# EAGLE schematic uNimbus_board_2_v1_2 (EAGLE 9.3.1)

## Sheet 1 of 4
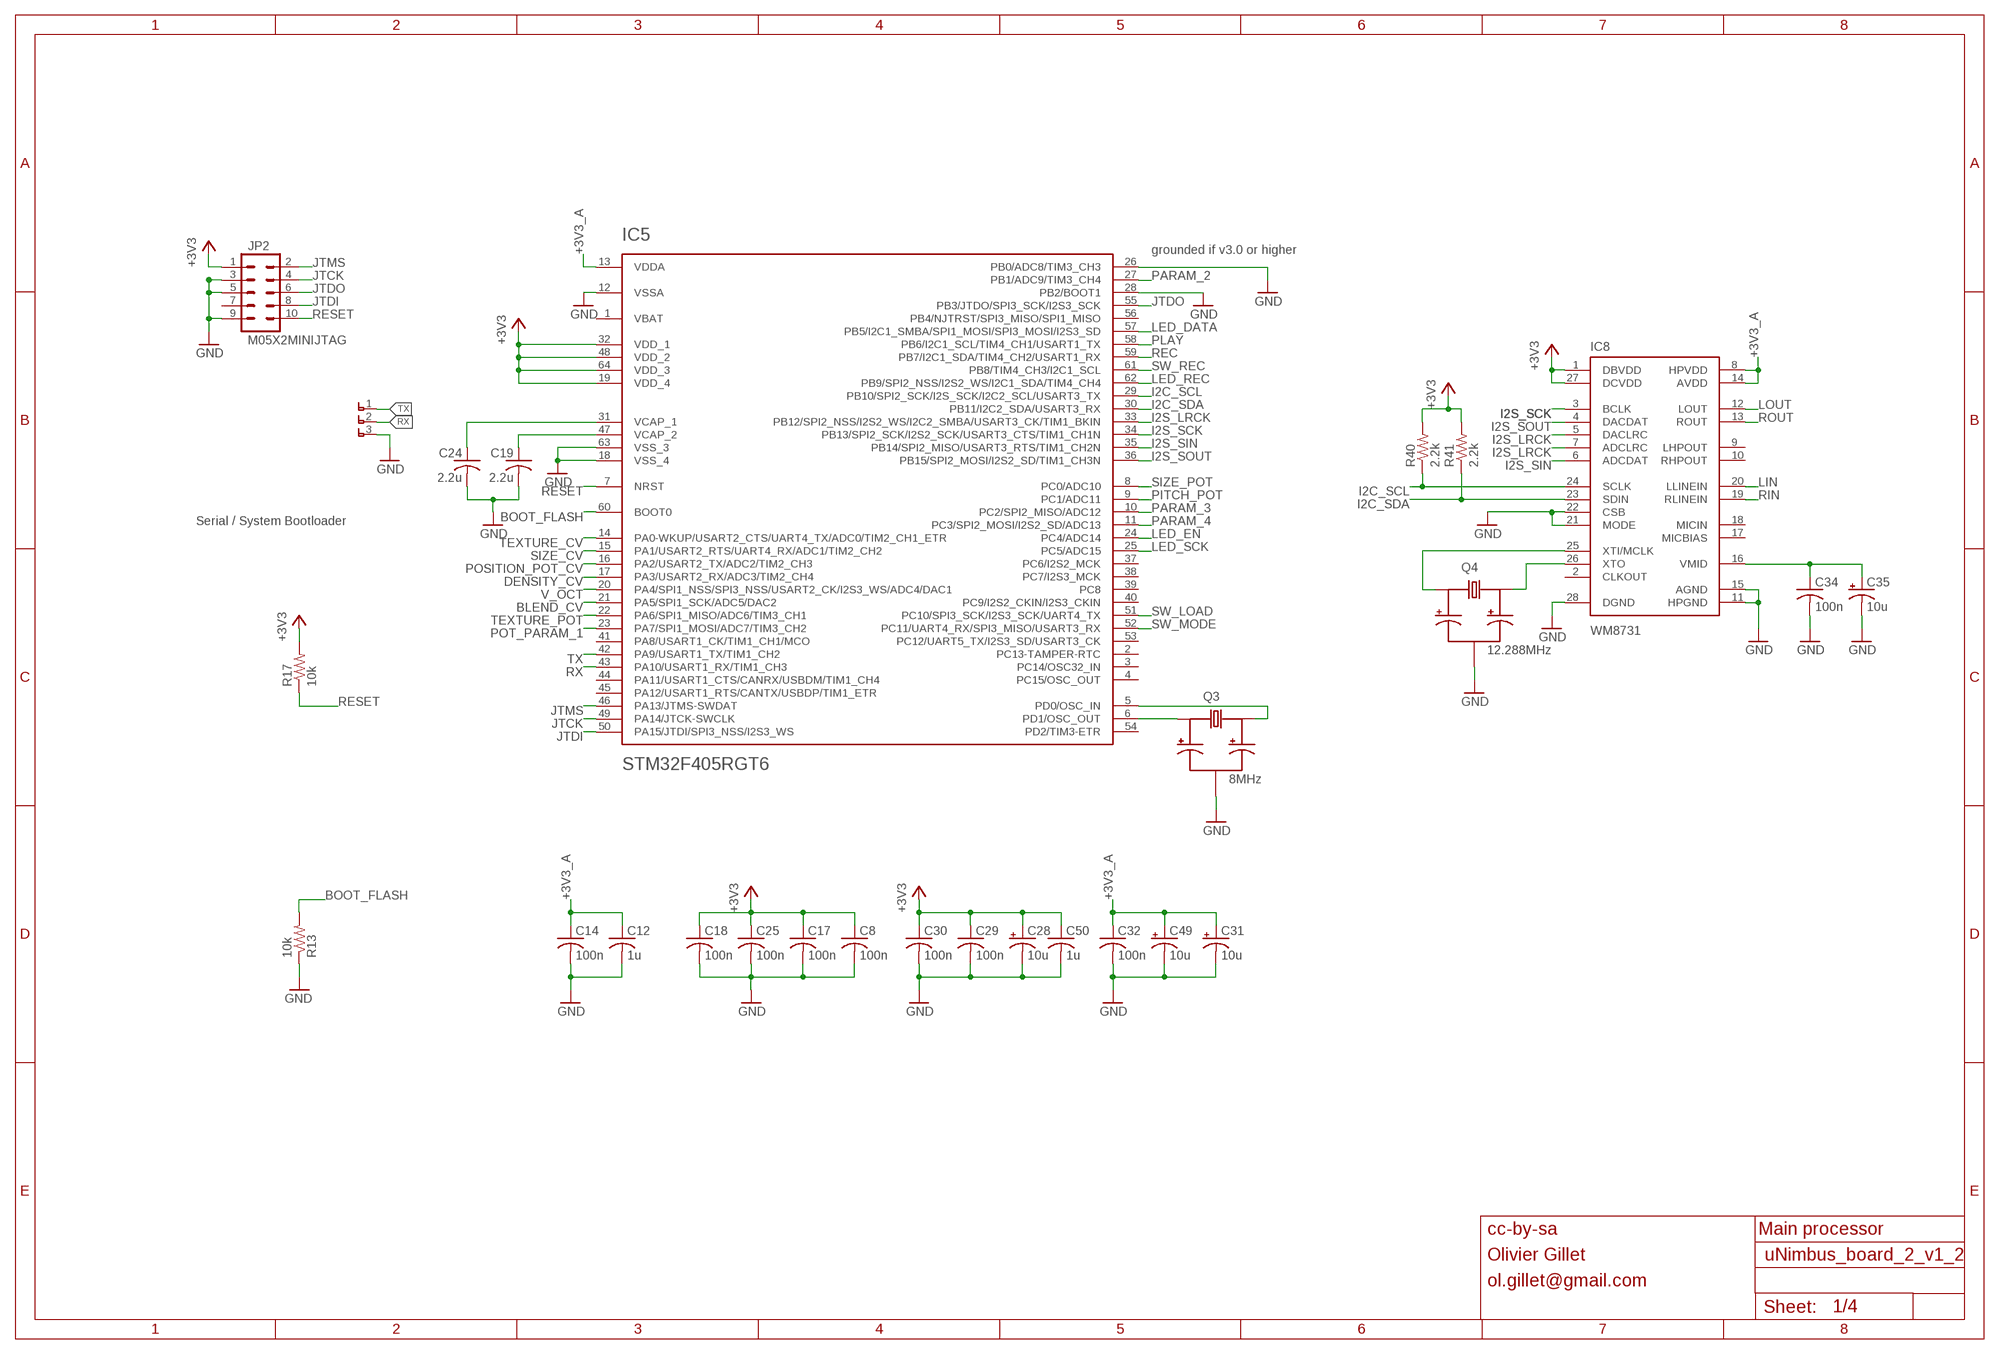
[diagram p0: schematic, sheet 1]

### Parts
C8  100n  C-USC0603  [C0603]
C12  1u  C-USC0603K  [C0603K]
C14  100n  C-USC0603K  [C0603K]
C17  100n  C-USC0603K  [C0603K]
C18  100n  C-USC0603K  [C0603K]
C19  2.2u  C-USC0805K  [C0805K]
C24  2.2u  C-USC0805K  [C0805K]
C25  100n  C-USC0603K  [C0603K]
C28  10u  CPOL-US153CLV-0405  [153CLV-0405]
C29  100n  C-USC0603K  [C0603K]
C30  100n  C-USC0603K  [C0603K]
C31  10u  CPOL-USB  [PANASONIC_B]
C32  100n  C-USC0603  [C0603]
C34  100n  C-USC0603  [C0603]
C35  10u  CPOL-USB  [PANASONIC_B]
C49  10u  CPOL-USA  [PANASONIC_A]
C50  1u  C-USC0603K  [C0603K]
IC5  STM32F405RGT6  STM32F20X  [TQFP-10X10-64]
IC8  WM8731  [SSOP28]
JP2  M05X2MINIJTAG  [2X5-1.27]
Q3  8MHz  CRYSTAL_SMALLER  [CRYSTAL_SMALLER]
Q4  12.288MHz  CRYSTAL_SMALLER  [CRYSTAL_SMALLER]
R13  10k  PARTS_AMAN_RESISTOR  [PARTS_AMAN_RESISTOR_0603]
R17  10k  PARTS_AMAN_RESISTOR  [PARTS_AMAN_RESISTOR_0603]
R40  2.2k  PARTS_AMAN_RESISTOR  [PARTS_AMAN_RESISTOR_0603]
R41  2.2k  PARTS_AMAN_RESISTOR  [PARTS_AMAN_RESISTOR_0603]
U$4  1X3_SMALL  [1X3_SMALL]

### Nets
+3V3: C8.1 C17.1 C18.1 C25.1 C28.+ C29.1 C30.1 C50.1 IC5.19(VDD_4) IC5.32(VDD_1) IC5.48(VDD_2) IC5.64(VDD_3) IC8.1(DBVDD) IC8.27(DCVDD) JP2.1 R17.2 R40.2 R41.2 ; also sheet 3,4
+3V3_A: C12.1 C14.1 C31.+ C32.1 C49.+ IC5.13(VDDA) IC8.8(HPVDD) IC8.14(AVDD) ; also sheet 2,3,4
BLEND_CV: IC5.21(PA5/SPI1_SCK/ADC5/DAC2) ; also sheet 2
BOOT_FLASH: IC5.60(BOOT0) R13.2
DENSITY_CV: IC5.17(PA3/USART2_RX/ADC3/TIM2_CH4) ; also sheet 2
GND: C8.2 C12.2 C14.2 C17.2 C18.2 C19.2 C24.2 C25.2 C28.- C29.2 C30.2 C31.- C32.2 C34.2 C35.- C49.- C50.2 IC5.12(VSSA) IC5.18(VSS_4) IC5.26(PB0/ADC8/TIM3_CH3) IC5.28(PB2/BOOT1) IC5.63(VSS_3) IC8.11(HPGND) IC8.15(AGND) IC8.21(MODE) IC8.22(CSB) IC8.28(DGND) JP2.3 JP2.5 JP2.9 Q3.GND Q4.GND R13.1 U$4.3 ; also sheet 2,3,4
I2C_SCL: IC5.29(PB10/SPI2_SCK/I2S_SCK/I2C2_SCL/USART3_TX) IC8.24(SCLK) R40.1
I2C_SDA: IC5.30(PB11/I2C2_SDA/USART3_RX) IC8.23(SDIN) R41.1
I2S_LRCK: IC5.33(PB12/SPI2_NSS/I2S2_WS/I2C2_SMBA/USART3_CK/TIM1_BKIN) IC8.5(DACLRC) IC8.7(ADCLRC)
I2S_SCK: IC5.34(PB13/SPI2_SCK/I2S2_SCK/USART3_CTS/TIM1_CH1N) IC8.3(BCLK)
I2S_SIN: IC5.35(PB14/SPI2_MISO/USART3_RTS/TIM1_CH2N) IC8.6(ADCDAT)
I2S_SOUT: IC5.36(PB15/SPI2_MOSI/I2S2_SD/TIM1_CH3N) IC8.4(DACDAT)
JTCK: IC5.49(PA14/JTCK-SWCLK) JP2.4
JTDI: IC5.50(PA15/JTDI/SPI3_NSS/I2S3_WS) JP2.8
JTDO: IC5.55(PB3/JTDO/SPI3_SCK/I2S3_SCK) JP2.6
JTMS: IC5.46(PA13/JTMS-SWDAT) JP2.2
LED_DATA: IC5.57(PB5/I2C1_SMBA/SPI1_MOSI/SPI3_MOSI/I2S3_SD) ; also sheet 3
LED_EN: IC5.24(PC4/ADC14) ; also sheet 3
LED_REC: IC5.62(PB9/SPI2_NSS/I2S2_WS/I2C1_SDA/TIM4_CH4) ; also sheet 3
LED_SCK: IC5.25(PC5/ADC15) ; also sheet 3
LIN: IC8.20(LLINEIN) ; also sheet 2
LOUT: IC8.12(LOUT) ; also sheet 2
N$3: IC5.6(PD1/OSC_OUT) Q3.X1
N$7: IC8.25(XTI/MCLK) Q4.X1
N$8: IC5.5(PD0/OSC_IN) Q3.X2
N$13: C19.1 IC5.47(VCAP_2)
N$17: C34.1 C35.+ IC8.16(VMID)
N$19: C24.1 IC5.31(VCAP_1)
N$59: IC8.26(XTO) Q4.X2
PARAM_2: IC5.27(PB1/ADC9/TIM3_CH4) ; also sheet 2
PARAM_3: IC5.10(PC2/SPI2_MISO/ADC12) ; also sheet 2
PARAM_4: IC5.11(PC3/SPI2_MOSI/I2S2_SD/ADC13) ; also sheet 2
PITCH_POT: IC5.9(PC1/ADC11) ; also sheet 3
PLAY: IC5.58(PB6/I2C1_SCL/TIM4_CH1/USART1_TX) ; also sheet 3
POSITION_POT_CV: IC5.16(PA2/USART2_TX/ADC2/TIM2_CH3) ; also sheet 2
POT_PARAM_1: IC5.23(PA7/SPI1_MOSI/ADC7/TIM3_CH2) ; also sheet 3
REC: IC5.59(PB7/I2C1_SDA/TIM4_CH2/USART1_RX) ; also sheet 3
RESET: IC5.7(NRST) JP2.10 R17.1
RIN: IC8.19(RLINEIN) ; also sheet 2
ROUT: IC8.13(ROUT) ; also sheet 2
RX: IC5.43(PA10/USART1_RX/TIM1_CH3) U$4.2
SIZE_CV: IC5.15(PA1/USART2_RTS/UART4_RX/ADC1/TIM2_CH2) ; also sheet 2
SIZE_POT: IC5.8(PC0/ADC10) ; also sheet 3
SW_LOAD: IC5.51(PC10/SPI3_SCK/I2S3_SCK/UART4_TX) ; also sheet 3
SW_MODE: IC5.52(PC11/UART4_RX/SPI3_MISO/USART3_RX) ; also sheet 3
SW_REC: IC5.61(PB8/TIM4_CH3/I2C1_SCL) ; also sheet 3
TEXTURE_CV: IC5.14(PA0-WKUP/USART2_CTS/UART4_TX/ADC0/TIM2_CH1_ETR) ; also sheet 2
TEXTURE_POT: IC5.22(PA6/SPI1_MISO/ADC6/TIM3_CH1) ; also sheet 3
TX: IC5.42(PA9/USART1_TX/TIM1_CH2) U$4.1
V_OCT: IC5.20(PA4/SPI1_NSS/SPI3_NSS/USART2_CK/I2S3_WS/ADC4/DAC1) ; also sheet 2
Unconnected: IC5.2(PC13-TAMPER-RTC) IC5.3(PC14/OSC32_IN) IC5.4(PC15/OSC_OUT) IC5.37(PC6/I2S2_MCK) IC5.38(PC7/I2S3_MCK) IC5.39(PC8) IC5.40(PC9/I2S2_CKIN/I2S3_CKIN) IC5.41(PA8/USART1_CK/TIM1_CH1/MCO) IC5.44(PA11/USART1_CTS/CANRX/USBDM/TIM1_CH4) IC5.45(PA12/USART1_RTS/CANTX/USBDP/TIM1_ETR) IC5.53(PC12/UART5_TX/I2S3_SD/USART3_CK) IC5.54(PD2/TIM3-ETR) IC5.56(PB4/NJTRST/SPI3_MISO/SPI1_MISO) IC8.2(CLKOUT) IC8.9(LHPOUT) IC8.10(RHPOUT) IC8.17(MICBIAS) IC8.18(MICIN) JP2.7

### Notes on the sheet
- grounded if v3.0 or higher
- Serial / System Bootloader
- cc-by-sa | Main processor
- Olivier Gillet
- ol.gillet@gmail.com

## Sheet 2 of 4
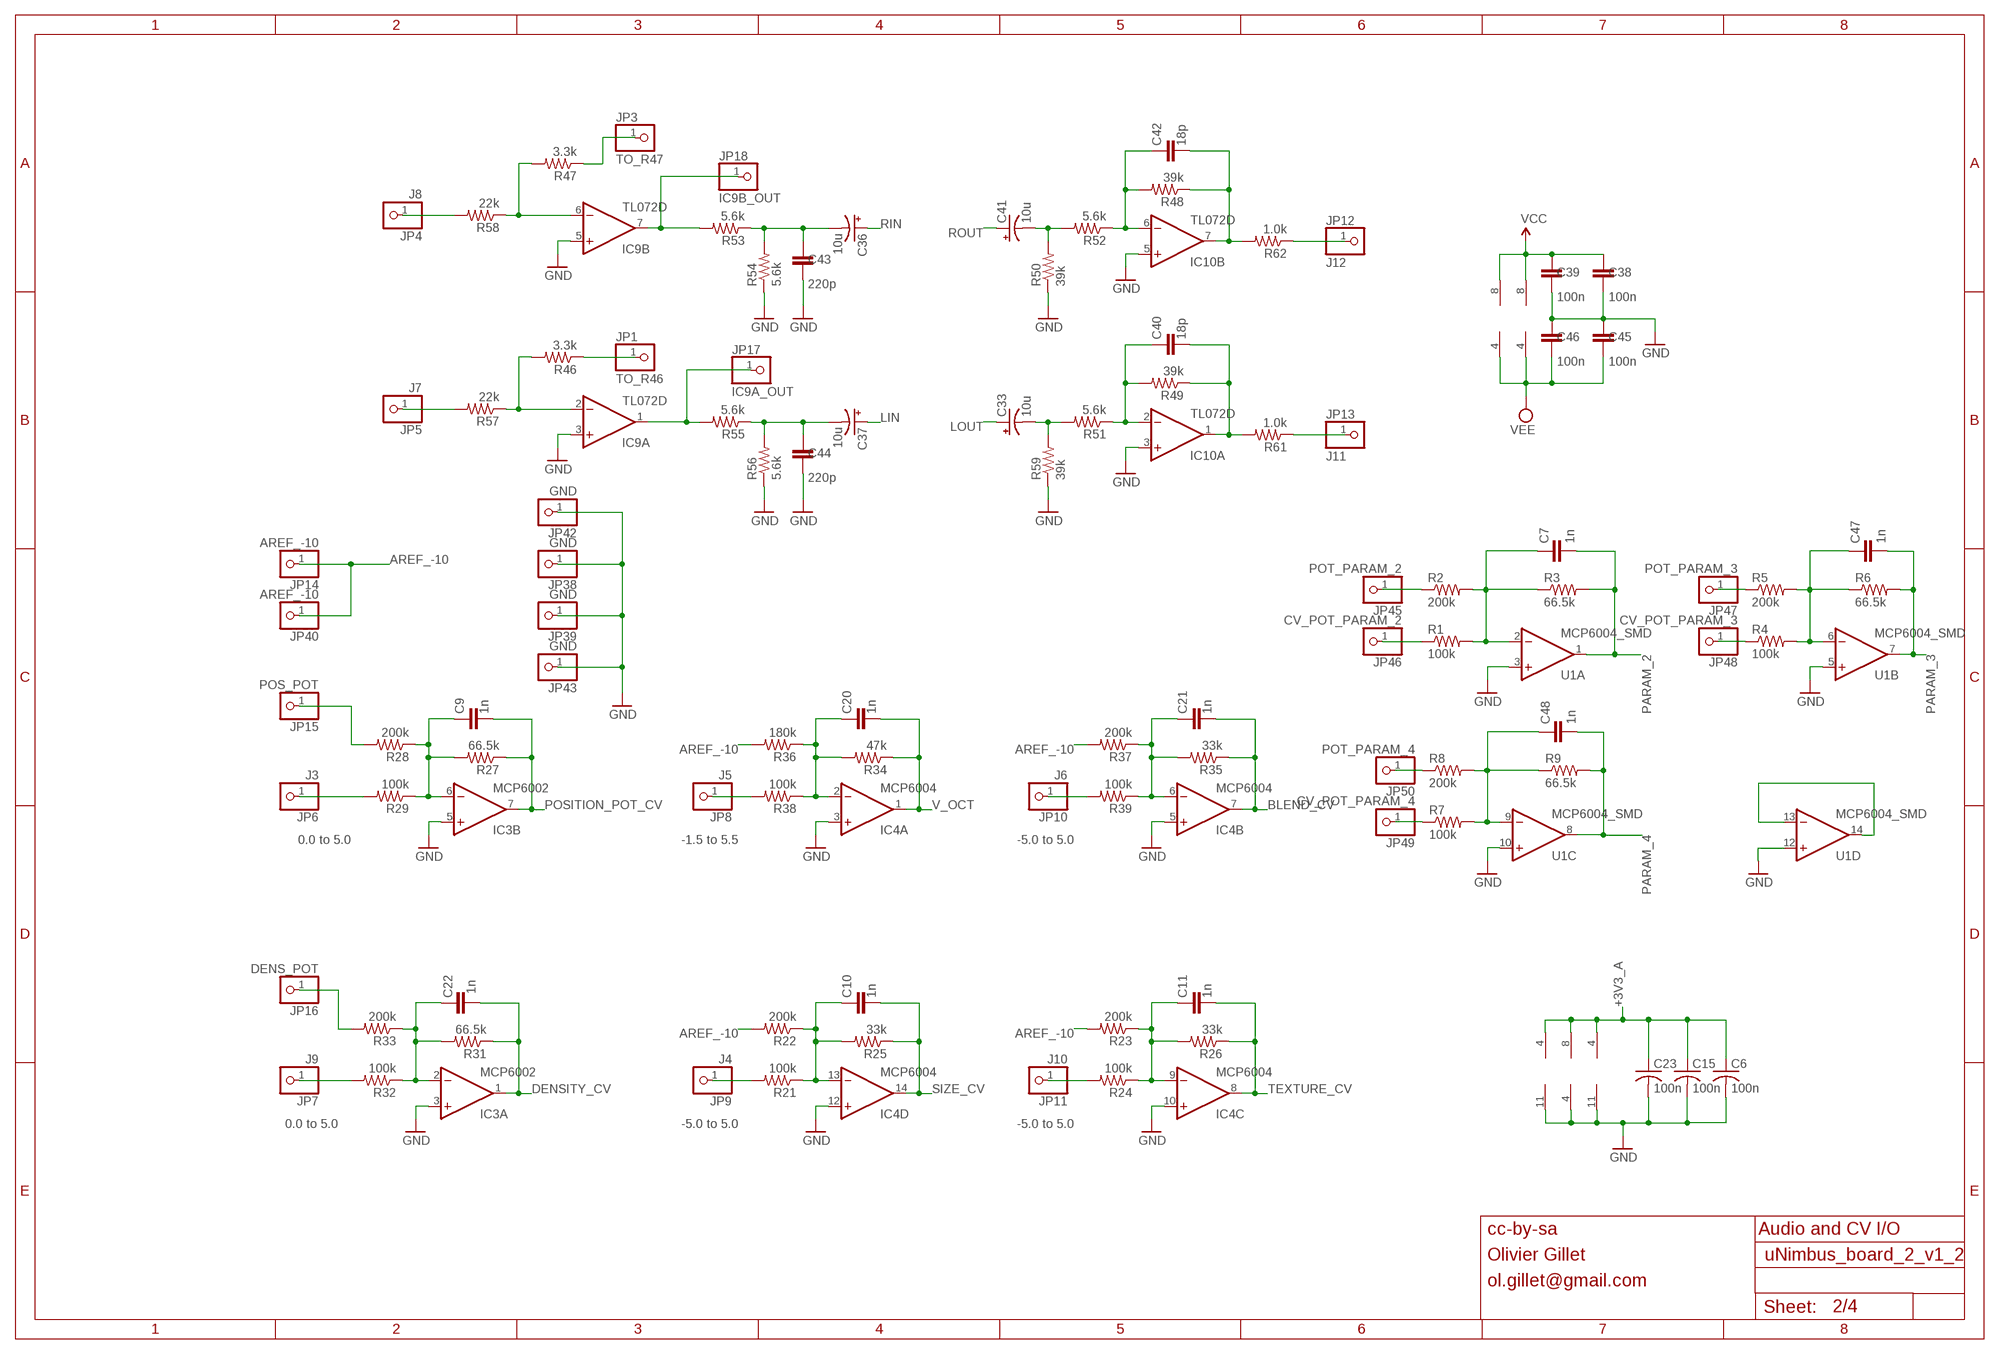
[diagram p1: schematic, sheet 2]

### Parts
C6  100n  C-USC0603K  [C0603K]
C7  1n  PARTS_AMAN_CAPACITOR  [PARTS_AMAN_RESISTOR_0603]
C9  1n  PARTS_AMAN_CAPACITOR  [PARTS_AMAN_RESISTOR_0603]
C10  1n  PARTS_AMAN_CAPACITOR  [PARTS_AMAN_RESISTOR_0603]
C11  1n  PARTS_AMAN_CAPACITOR  [PARTS_AMAN_RESISTOR_0603]
C15  100n  C-USC0603K  [C0603K]
C20  1n  PARTS_AMAN_CAPACITOR  [PARTS_AMAN_RESISTOR_0603]
C21  1n  PARTS_AMAN_CAPACITOR  [PARTS_AMAN_RESISTOR_0603]
C22  1n  PARTS_AMAN_CAPACITOR  [PARTS_AMAN_RESISTOR_0603]
C23  100n  C-USC0603  [C0603]
C33  10u  CPOL-USB  [PANASONIC_B]
C36  10u  CPOL-USB  [PANASONIC_B]
C37  10u  CPOL-USB  [PANASONIC_B]
C38  100n  PARTS_AMAN_CAPACITOR  [PARTS_AMAN_RESISTOR_0603]
C39  100n  PARTS_AMAN_CAPACITOR  [PARTS_AMAN_RESISTOR_0603]
C40  18p  PARTS_AMAN_CAPACITOR  [PARTS_AMAN_RESISTOR_0603]
C41  10u  CPOL-USB  [PANASONIC_B]
C42  18p  PARTS_AMAN_CAPACITOR  [PARTS_AMAN_RESISTOR_0603]
C43  220p  PARTS_AMAN_CAPACITOR  [PARTS_AMAN_RESISTOR_0603]
C44  220p  PARTS_AMAN_CAPACITOR  [PARTS_AMAN_RESISTOR_0603]
C45  100n  PARTS_AMAN_CAPACITOR  [PARTS_AMAN_RESISTOR_0603]
C46  100n  PARTS_AMAN_CAPACITOR  [PARTS_AMAN_RESISTOR_0603]
C47  1n  PARTS_AMAN_CAPACITOR  [PARTS_AMAN_RESISTOR_0603]
C48  1n  PARTS_AMAN_CAPACITOR  [PARTS_AMAN_RESISTOR_0603]
IC3  MCP6002  TL072D  [SO08]
IC4  MCP6004  TL074D  [SO14]
IC9  TL072D  [SO08]
IC10  TL072D  [SO08]
JP1  TO_R46  PARTS_AMAN_PINHD-1X1  [PARTS_AMAN_1X01]
JP3  TO_R47  PARTS_AMAN_PINHD-1X1  [PARTS_AMAN_1X01]
JP4  J8  PARTS_AMAN_PINHD-1X1  [PARTS_AMAN_1X01]
JP5  J7  PARTS_AMAN_PINHD-1X1  [PARTS_AMAN_1X01]
JP6  J3  PARTS_AMAN_PINHD-1X1  [PARTS_AMAN_1X01]
JP7  J9  PARTS_AMAN_PINHD-1X1  [PARTS_AMAN_1X01]
JP8  J5  PARTS_AMAN_PINHD-1X1  [PARTS_AMAN_1X01]
JP9  J4  PARTS_AMAN_PINHD-1X1  [PARTS_AMAN_1X01]
JP10  J6  PARTS_AMAN_PINHD-1X1  [PARTS_AMAN_1X01]
JP11  J10  PARTS_AMAN_PINHD-1X1  [PARTS_AMAN_1X01]
JP12  J12  PARTS_AMAN_PINHD-1X1  [PARTS_AMAN_1X01]
JP13  J11  PARTS_AMAN_PINHD-1X1  [PARTS_AMAN_1X01]
JP14  AREF_-10  PARTS_AMAN_PINHD-1X1  [PARTS_AMAN_1X01]
JP15  POS_POT  PARTS_AMAN_PINHD-1X1  [PARTS_AMAN_1X01]
JP16  DENS_POT  PARTS_AMAN_PINHD-1X1  [PARTS_AMAN_1X01]
JP17  IC9A_OUT  PARTS_AMAN_PINHD-1X1  [PARTS_AMAN_1X01]
JP18  IC9B_OUT  PARTS_AMAN_PINHD-1X1  [PARTS_AMAN_1X01]
JP38  GND  PARTS_AMAN_PINHD-1X1  [PARTS_AMAN_1X01]
JP39  GND  PARTS_AMAN_PINHD-1X1  [PARTS_AMAN_1X01]
JP40  AREF_-10  PARTS_AMAN_PINHD-1X1  [PARTS_AMAN_1X01]
JP42  GND  PARTS_AMAN_PINHD-1X1  [PARTS_AMAN_1X01]
JP43  GND  PARTS_AMAN_PINHD-1X1  [PARTS_AMAN_1X01]
JP45  POT_PARAM_2  PARTS_AMAN_PINHD-1X1  [PARTS_AMAN_1X01]
JP46  CV_POT_PARAM_2  PARTS_AMAN_PINHD-1X1  [PARTS_AMAN_1X01]
JP47  POT_PARAM_3  PARTS_AMAN_PINHD-1X1  [PARTS_AMAN_1X01]
JP48  CV_POT_PARAM_3  PARTS_AMAN_PINHD-1X1  [PARTS_AMAN_1X01]
JP49  CV_POT_PARAM_4  PARTS_AMAN_PINHD-1X1  [PARTS_AMAN_1X01]
JP50  POT_PARAM_4  PARTS_AMAN_PINHD-1X1  [PARTS_AMAN_1X01]
R1  100k  PARTS_AMAN_RESISTOR  [PARTS_AMAN_RESISTOR_0603]
R2  200k  PARTS_AMAN_RESISTOR  [PARTS_AMAN_RESISTOR_0603]
R3  66.5k  PARTS_AMAN_RESISTOR  [PARTS_AMAN_RESISTOR_0603]
R4  100k  PARTS_AMAN_RESISTOR  [PARTS_AMAN_RESISTOR_0603]
R5  200k  PARTS_AMAN_RESISTOR  [PARTS_AMAN_RESISTOR_0603]
R6  66.5k  PARTS_AMAN_RESISTOR  [PARTS_AMAN_RESISTOR_0603]
R7  100k  PARTS_AMAN_RESISTOR  [PARTS_AMAN_RESISTOR_0603]
R8  200k  PARTS_AMAN_RESISTOR  [PARTS_AMAN_RESISTOR_0603]
R9  66.5k  PARTS_AMAN_RESISTOR  [PARTS_AMAN_RESISTOR_0603]
R21  100k  PARTS_AMAN_RESISTOR  [PARTS_AMAN_RESISTOR_0603]
R22  200k  PARTS_AMAN_RESISTOR  [PARTS_AMAN_RESISTOR_0603]
R23  200k  PARTS_AMAN_RESISTOR  [PARTS_AMAN_RESISTOR_0603]
R24  100k  PARTS_AMAN_RESISTOR  [PARTS_AMAN_RESISTOR_0603]
R25  33k  PARTS_AMAN_RESISTOR  [PARTS_AMAN_RESISTOR_0603]
R26  33k  PARTS_AMAN_RESISTOR  [PARTS_AMAN_RESISTOR_0603]
R27  66.5k  PARTS_AMAN_RESISTOR  [PARTS_AMAN_RESISTOR_0603]
R28  200k  PARTS_AMAN_RESISTOR  [PARTS_AMAN_RESISTOR_0603]
R29  100k  PARTS_AMAN_RESISTOR  [PARTS_AMAN_RESISTOR_0603]
R31  66.5k  PARTS_AMAN_RESISTOR  [PARTS_AMAN_RESISTOR_0603]
R32  100k  PARTS_AMAN_RESISTOR  [PARTS_AMAN_RESISTOR_0603]
R33  200k  PARTS_AMAN_RESISTOR  [PARTS_AMAN_RESISTOR_0603]
R34  47k  PARTS_AMAN_RESISTOR  [PARTS_AMAN_RESISTOR_0603]
R35  33k  PARTS_AMAN_RESISTOR  [PARTS_AMAN_RESISTOR_0603]
R36  180k  PARTS_AMAN_RESISTOR  [PARTS_AMAN_RESISTOR_0603]
R37  200k  PARTS_AMAN_RESISTOR  [PARTS_AMAN_RESISTOR_0603]
R38  100k  PARTS_AMAN_RESISTOR  [PARTS_AMAN_RESISTOR_0603]
R39  100k  PARTS_AMAN_RESISTOR  [PARTS_AMAN_RESISTOR_0603]
R46  3.3k  PARTS_AMAN_RESISTOR  [PARTS_AMAN_RESISTOR_0603]
R47  3.3k  PARTS_AMAN_RESISTOR  [PARTS_AMAN_RESISTOR_0603]
R48  39k  PARTS_AMAN_RESISTOR  [PARTS_AMAN_RESISTOR_0603]
R49  39k  PARTS_AMAN_RESISTOR  [PARTS_AMAN_RESISTOR_0603]
R50  39k  PARTS_AMAN_RESISTOR  [PARTS_AMAN_RESISTOR_0603]
R51  5.6k  PARTS_AMAN_RESISTOR  [PARTS_AMAN_RESISTOR_0603]
R52  5.6k  PARTS_AMAN_RESISTOR  [PARTS_AMAN_RESISTOR_0603]
R53  5.6k  PARTS_AMAN_RESISTOR  [PARTS_AMAN_RESISTOR_0603]
R54  5.6k  PARTS_AMAN_RESISTOR  [PARTS_AMAN_RESISTOR_0603]
R55  5.6k  PARTS_AMAN_RESISTOR  [PARTS_AMAN_RESISTOR_0603]
R56  5.6k  PARTS_AMAN_RESISTOR  [PARTS_AMAN_RESISTOR_0603]
R57  22k  PARTS_AMAN_RESISTOR  [PARTS_AMAN_RESISTOR_0603]
R58  22k  PARTS_AMAN_RESISTOR  [PARTS_AMAN_RESISTOR_0603]
R59  39k  PARTS_AMAN_RESISTOR  [PARTS_AMAN_RESISTOR_0603]
R61  1.0k  PARTS_AMAN_RESISTOR  [PARTS_AMAN_RESISTOR_0603]
R62  1.0k  PARTS_AMAN_RESISTOR  [PARTS_AMAN_RESISTOR_0603]
U1  MCP6004_SMD  [SO14]

### Nets
+3V3_A: C6.1 C15.1 C23.1 IC3.8(P:V+) IC4.4(P:V+) U1.4(P:V+) ; also sheet 1,3,4
AREF_-10: JP14.1 JP40.1 R22.2 R23.2 R36.2 R37.2 ; also sheet 4
BLEND_CV: C21.2 IC4.7(B:OUT) R35.1 ; also sheet 1
DENSITY_CV: C22.2 IC3.1(A:OUT) R31.1 ; also sheet 1
GND: C6.2 C15.2 C23.2 C38.2 C39.2 C43.2 C44.2 C45.1 C46.1 IC3.3(A:+IN) IC3.4(P:V-) IC3.5(B:+IN) IC4.3(A:+IN) IC4.5(B:+IN) IC4.10(C:+IN) IC4.11(P:V-) IC4.12(D:+IN) IC9.3(A:+IN) IC9.5(B:+IN) IC10.3(A:+IN) IC10.5(B:+IN) JP38.1 JP39.1 JP42.1 JP43.1 R50.1 R54.1 R56.1 R59.1 U1.3(A:+IN) U1.5(B:+IN) U1.10(C:+IN) U1.11(P:V-) U1.12(D:+IN) ; also sheet 1,3,4
LIN: C37.+ ; also sheet 1
LOUT: C33.+ ; also sheet 1
LOUT_JACK: JP13.1 R61.1
N$1: JP9.1 R21.2
N$2: C10.1 IC4.13(D:-IN) R21.1 R22.1 R25.2
N$4: JP11.1 R24.2
N$5: C11.1 IC4.9(C:-IN) R23.1 R24.1 R26.2
N$6: JP10.1 R39.2
N$9: JP46.1 R1.1
N$10: JP8.1 R38.2
N$11: C20.1 IC4.2(A:-IN) R34.2 R36.1 R38.1
N$12: C7.1 R1.2 R2.2 R3.1 U1.2(A:-IN)
N$14: JP7.1 R32.2
N$15: C21.1 IC4.6(B:-IN) R35.2 R37.1 R39.1
N$16: JP45.1 R2.1
N$18: C37.- C44.1 R55.1 R56.2
N$20: JP4.1 R58.2
N$21: JP5.1 R57.2
N$22: C36.- C43.1 R53.1 R54.2
N$23: C41.- R50.2 R52.2
N$24: C22.1 IC3.2(A:-IN) R31.2 R32.1 R33.1
N$25: C42.1 IC10.6(B:-IN) R48.2 R52.1
N$26: JP16.1 R33.2
N$27: JP6.1 R29.2
N$28: C42.2 IC10.7(B:OUT) R48.1 R62.2
N$29: JP47.1 R5.1
N$30: C9.1 IC3.6(B:-IN) R27.2 R28.1 R29.1
N$31: C33.- R51.2 R59.2
N$32: C40.1 IC10.2(A:-IN) R49.2 R51.1
N$33: C40.2 IC10.1(A:OUT) R49.1 R61.2
N$34: U1.13(D:-IN) U1.14(D:OUT)
N$35: JP15.1 R28.2
N$38: JP48.1 R4.1
N$39: C47.1 R4.2 R5.2 R6.1 U1.6(B:-IN)
N$42: JP1.1 R46.1
N$49: JP49.1 R7.1
N$50: JP50.1 R8.1
N$51: IC9.7(B:OUT) JP18.1 R53.2
N$52: JP3.1 R47.1
N$54: IC9.6(B:-IN) R47.2 R58.1
N$56: IC9.1(A:OUT) JP17.1 R55.2
N$58: IC9.2(A:-IN) R46.2 R57.1
N$64: C48.1 R7.2 R8.2 R9.1 U1.9(C:-IN)
PARAM_2: C7.2 R3.2 U1.1(A:OUT) ; also sheet 1
PARAM_3: C47.2 R6.2 U1.7(B:OUT) ; also sheet 1
PARAM_4: C48.2 R9.2 U1.8(C:OUT) ; also sheet 1
POSITION_POT_CV: C9.2 IC3.7(B:OUT) R27.1 ; also sheet 1
RIN: C36.+ ; also sheet 1
ROUT: C41.+ ; also sheet 1
ROUT_JACK: JP12.1 R62.1
SIZE_CV: C10.2 IC4.14(D:OUT) R25.1 ; also sheet 1
TEXTURE_CV: C11.2 IC4.8(C:OUT) R26.1 ; also sheet 1
V_OCT: C20.2 IC4.1(A:OUT) R34.1 ; also sheet 1
VCC: C38.1 C39.1 IC9.8(P:V+) IC10.8(P:V+) ; also sheet 4
VEE: C45.2 C46.2 IC9.4(P:V-) IC10.4(P:V-) ; also sheet 4

### Notes on the sheet
- 0.0 to 5.0 | -1.5 to 5.5 | -5.0 to 5.0
- 0.0 to 5.0 | -5.0 to 5.0 | -5.0 to 5.0
- cc-by-sa | Audio and CV I/O
- Olivier Gillet
- ol.gillet@gmail.com

## Sheet 3 of 4
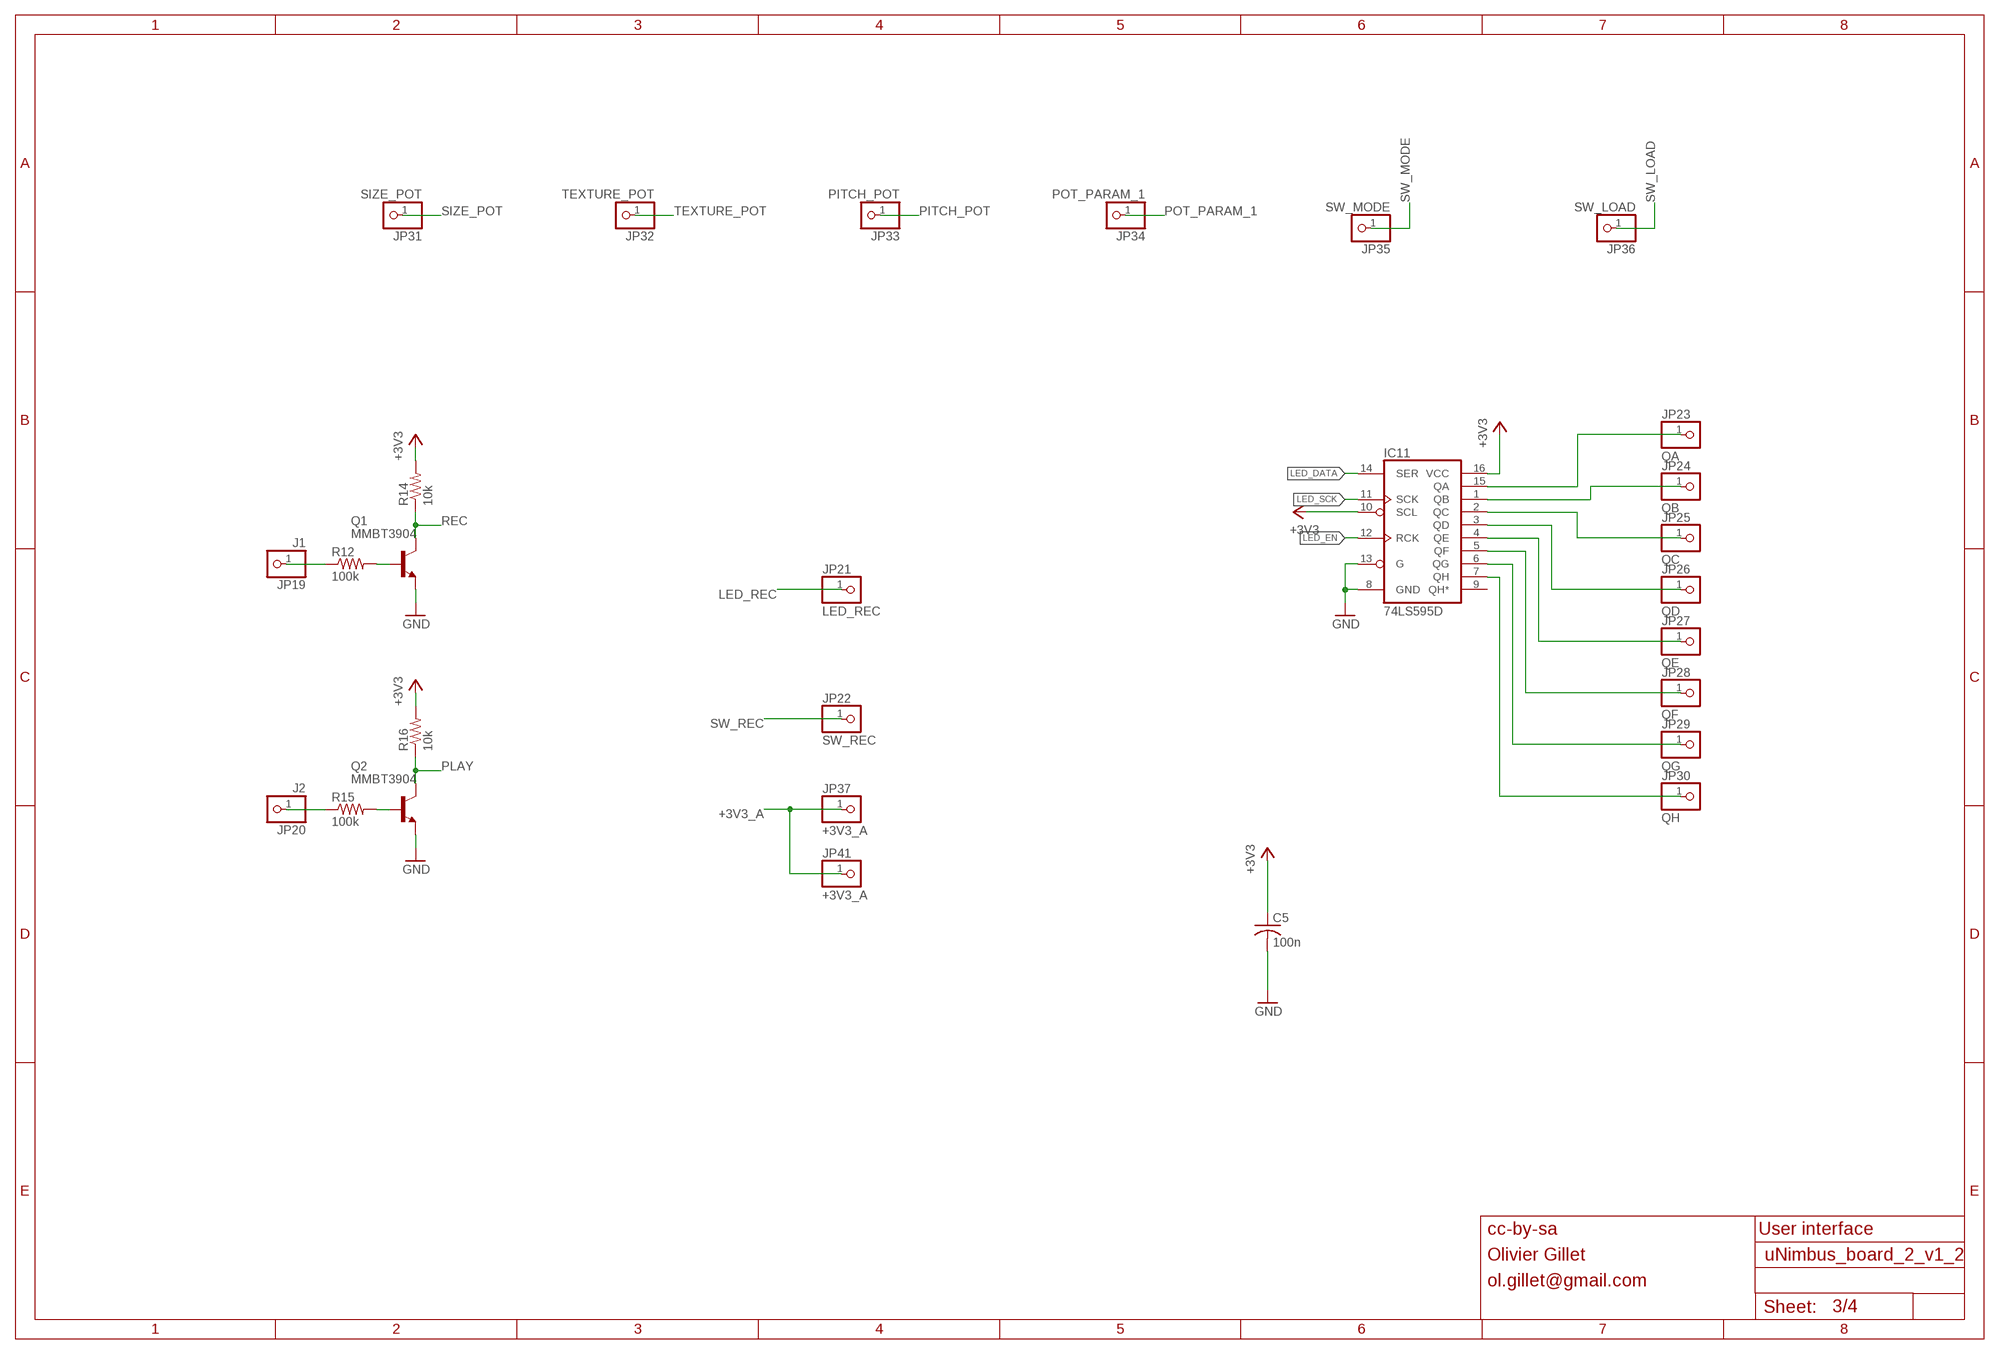
[diagram p2: schematic, sheet 3]

### Parts
C5  100n  C-USC0603  [C0603]
IC11  74LS595D  [SO16]
JP19  J1  PARTS_AMAN_PINHD-1X1  [PARTS_AMAN_1X01]
JP20  J2  PARTS_AMAN_PINHD-1X1  [PARTS_AMAN_1X01]
JP21  LED_REC  PARTS_AMAN_PINHD-1X1  [PARTS_AMAN_1X01]
JP22  SW_REC  PARTS_AMAN_PINHD-1X1  [PARTS_AMAN_1X01]
JP23  QA  PARTS_AMAN_PINHD-1X1  [PARTS_AMAN_1X01]
JP24  QB  PARTS_AMAN_PINHD-1X1  [PARTS_AMAN_1X01]
JP25  QC  PARTS_AMAN_PINHD-1X1  [PARTS_AMAN_1X01]
JP26  QD  PARTS_AMAN_PINHD-1X1  [PARTS_AMAN_1X01]
JP27  QE  PARTS_AMAN_PINHD-1X1  [PARTS_AMAN_1X01]
JP28  QF  PARTS_AMAN_PINHD-1X1  [PARTS_AMAN_1X01]
JP29  QG  PARTS_AMAN_PINHD-1X1  [PARTS_AMAN_1X01]
JP30  QH  PARTS_AMAN_PINHD-1X1  [PARTS_AMAN_1X01]
JP31  SIZE_POT  PARTS_AMAN_PINHD-1X1  [PARTS_AMAN_1X01]
JP32  TEXTURE_POT  PARTS_AMAN_PINHD-1X1  [PARTS_AMAN_1X01]
JP33  PITCH_POT  PARTS_AMAN_PINHD-1X1  [PARTS_AMAN_1X01]
JP34  POT_PARAM_1  PARTS_AMAN_PINHD-1X1  [PARTS_AMAN_1X01]
JP35  SW_MODE  PARTS_AMAN_PINHD-1X1  [PARTS_AMAN_1X01]
JP36  SW_LOAD  PARTS_AMAN_PINHD-1X1  [PARTS_AMAN_1X01]
JP37  +3V3_A  PARTS_AMAN_PINHD-1X1  [PARTS_AMAN_1X01]
JP41  +3V3_A  PARTS_AMAN_PINHD-1X1  [PARTS_AMAN_1X01]
Q1  MMBT3904  MMBT3904LT1-NPN-SOT23-BEC  [SOT23-BEC]
Q2  MMBT3904  MMBT3904LT1-NPN-SOT23-BEC  [SOT23-BEC]
R12  100k  R-US_R0603  [R0603]
R14  10k  R-US_R0603  [R0603]
R15  100k  R-US_R0603  [R0603]
R16  10k  R-US_R0603  [R0603]

### Nets
+3V3: C5.1 IC11.10(SCL) IC11.16(VCC) R14.2 R16.2 ; also sheet 1,4
+3V3_A: JP37.1 JP41.1 ; also sheet 1,2,4
GND: C5.2 IC11.8(GND) IC11.13(G) Q1.E Q2.E ; also sheet 1,2,4
LED_DATA: IC11.14(SER) ; also sheet 1
LED_EN: IC11.12(RCK) ; also sheet 1
LED_REC: JP21.1 ; also sheet 1
LED_SCK: IC11.11(SCK) ; also sheet 1
N$36: JP20.1 R15.1
N$37: Q2.B R15.2
N$43: IC11.15(QA) JP23.1
N$44: IC11.1(QB) JP24.1
N$45: IC11.2(QC) JP25.1
N$46: IC11.3(QD) JP26.1
N$47: IC11.4(QE) JP27.1
N$53: IC11.5(QF) JP28.1
N$57: JP19.1 R12.1
N$62: IC11.6(QG) JP29.1
N$63: IC11.7(QH) JP30.1
N$66: Q1.B R12.2
PITCH_POT: JP33.1 ; also sheet 1
PLAY: Q2.C R16.1 ; also sheet 1
POT_PARAM_1: JP34.1 ; also sheet 1
REC: Q1.C R14.1 ; also sheet 1
SIZE_POT: JP31.1 ; also sheet 1
SW_LOAD: JP36.1 ; also sheet 1
SW_MODE: JP35.1 ; also sheet 1
SW_REC: JP22.1 ; also sheet 1
TEXTURE_POT: JP32.1 ; also sheet 1
Unconnected: IC11.9(QH*)

### Notes on the sheet
- cc-by-sa | User interface
- Olivier Gillet
- ol.gillet@gmail.com

## Sheet 4 of 4
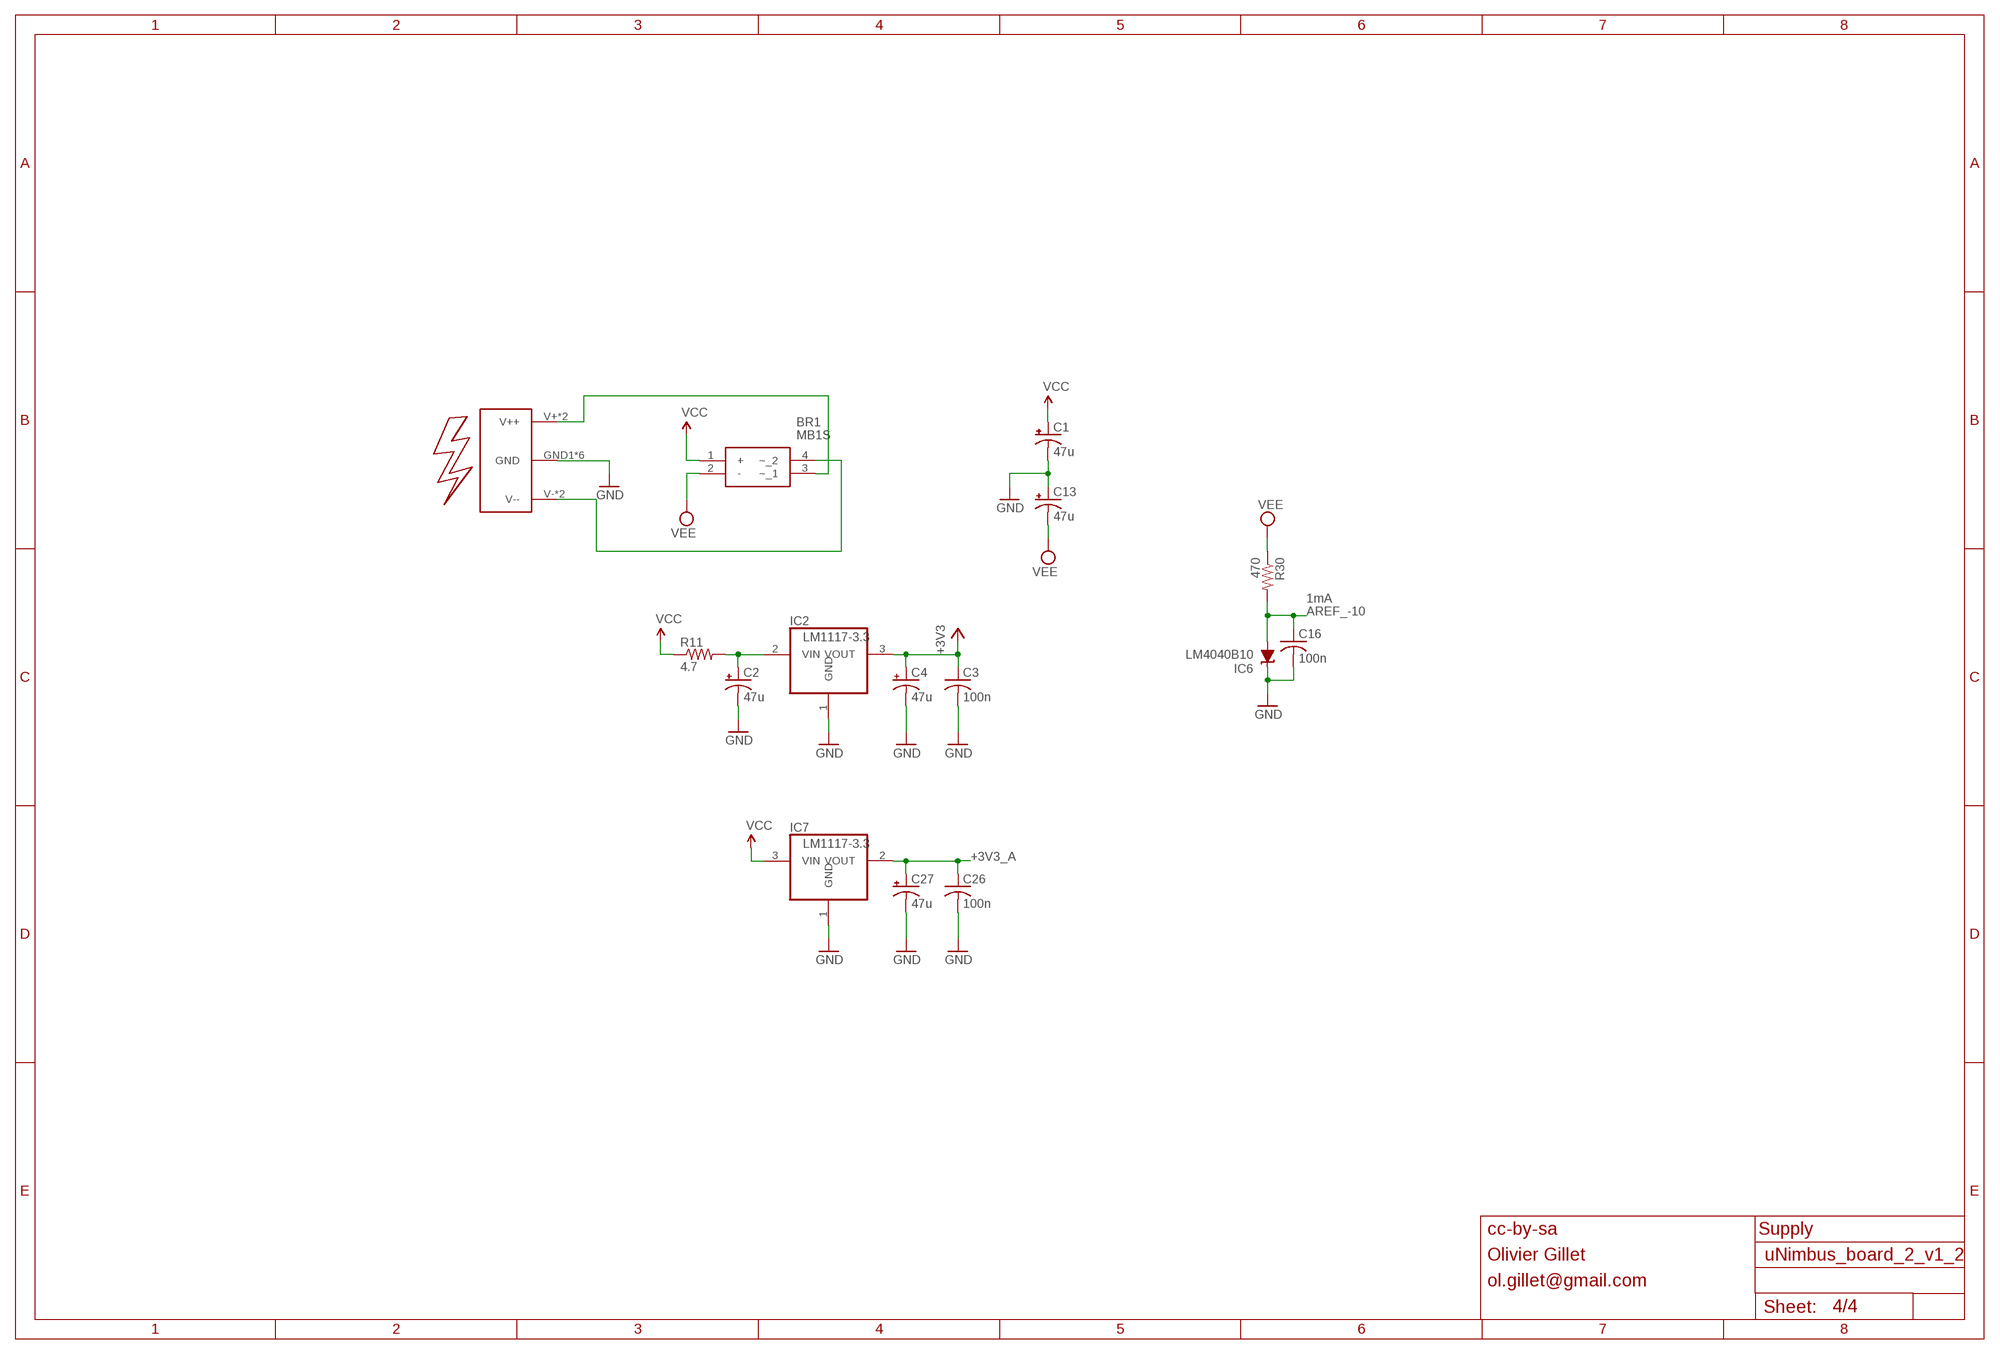
[diagram p3: schematic, sheet 4]

### Parts
BR1  MB1S  [SOP245P670X290-4N]
C1  47u  CPOL-US153CLV-0505  [153CLV-0505]
C2  47u  CPOL-US153CLV-0505  [153CLV-0505]
C3  100n  C-USC0603  [C0603]
C4  47u  CPOL-US153CLV-0505  [153CLV-0505]
C13  47u  CPOL-US153CLV-0505  [153CLV-0505]
C16  100n  C-USC0603  [C0603]
C26  100n  C-USC0603  [C0603]
C27  47u  CPOL-US153CLV-0505  [153CLV-0505]
IC2  LM1117-3.3  REG1117T  [TO252]
IC6  LM4040B10  LM4041B12DBZ  [DBZ_R-PDSO-G3]
IC7  LM1117-3.3  REG1117  [SOT223]
R11  4.7  R-US_R1206  [R1206]
R30  470  R-US_R0603  [R0603]
U$2  EURO_POWER2  [EURO_POWER2]

### Nets
+3V3: C3.1 C4.+ IC2.3(VOUT) ; also sheet 1,3
+3V3_A: C26.1 C27.+ IC7.2(VOUT) ; also sheet 1,2,3
AREF_-10: C16.1 IC6.2(A) R30.2 ; also sheet 2
GND: C1.- C2.- C3.2 C4.- C13.+ C16.2 C26.2 C27.- IC2.1(GND) IC6.1(C) IC7.1(GND) U$2.GND1(GND) U$2.GND2(GND) U$2.GND3(GND) U$2.GND4(GND) U$2.GND5(GND) U$2.GND6(GND) ; also sheet 1,2,3
N$55: C2.+ IC2.2(VIN) R11.2
N$60: BR1.3(~_1) U$2.V+(V++) U$2.V++
N$61: BR1.4(~_2) U$2.V-(V--) U$2.V--
VCC: BR1.1(+) C1.+ IC7.3(VIN) R11.1 ; also sheet 2
VEE: BR1.2(-) C13.- R30.1 ; also sheet 2

### Notes on the sheet
- 1mA
- cc-by-sa | Supply
- Olivier Gillet
- ol.gillet@gmail.com

## Power pins joined to a net without a drawn wire
VBAT: IC5.1(VBAT)

## Library data of the parts
BR1 = MB1S:MB1S: ON Semiconductor MB1S, Bridge Rectifier, 500mA 100V, 4-Pin SOIC Source: Datasheet <http://www.onsemi.com/pub/Collateral/MB8S-D.PDF>; DESCRIPTION: ON Semiconductor MB1S, Bridge Rectifier, 500mA 100V, 4-Pin SOIC; HEIGHT: 2.9mm; MANUFACTURER_NAME: ON Semiconductor; MANUFACTURER_PART_NUMBER: MB1S; MOUSER_PART_NUMBER: 512-MB1S; RS_PART_NUMBER: 7613650P; RS_PRICE-STOCK: http://uk.rs-online.com/web/p/products/7613650P
C1 C4 C13 C27 C31 C33 C35-C37 C41 C49 = rcl:CPOL-US: POLARIZED CAPACITOR, American symbol
C2 C28 = rcl@1:CPOL-US: POLARIZED CAPACITOR, American symbol
C3 C5 C8 C12 C14 C16-C18 C23 C26 C29 C32 C34 = rcl:C-US: CAPACITOR, American symbol
C6 C15 C19 C24 C25 C30 C50 = rcl@1:C-US: CAPACITOR, American symbol
C7 C9-C11 C20-C22 C38-C40 C42-C48 = atom_v1_1_board_2:PARTS_AMAN_CAPACITOR
IC2 IC7 = og-vreg:REG1117: 800mA and 1A Low Dropout (LDO) Positive Regulator 1.8V, 2.5V, 2.85V, 3.3V, 5V, and Adj
IC3 = gm-ics:TL072: OP AMP
IC4 = gm-ics:TL074: OP AMP
IC5 = og-stm32f2:STM32F20X
IC6 = texas:LM4041: PRECISION MICROPOWER SHUNT VOLTAGE REFERENCE Source: http://focus.ti.com/lit/ds/slcs146e/slcs146e.pdf
IC8 = og-dac:WM8731
IC9 IC10 = og-linear:TL072: OP AMP
IC11 = SparkFun-DigitalIC:74*595: 8-bit SHIFT REGISTER, output latch
JP1 JP3-JP43 JP45-JP50 = atom_v1_1_board_2:PARTS_AMAN_PINHD-1X1: PIN HEADER
JP2 = og-header:M05X2: Header 5x2 Standard 10-pin dual row 0.1" header. Commonly used with AVR-ISP. Use with Spark Fun Electronics SKU: PRT-00778
Q1 Q2 = transistor:*-NPN-: NPN Transistror BF959 corrected 2008.03.06
Q3 Q4 = INSTRUO:CRYSTAL_SMALLER: CSTCE16M0V53-R0
R1-R9 R13 R17 R21-R29 R31-R41 R46-R59 R61 R62 = atom_v1_1_board_2:PARTS_AMAN_RESISTOR
R11 R12 R14-R16 R30 = rcl:R-US_: RESISTOR, American symbol
U1 = MusicThingModular:MCP6004: Generic Quad Op Amp
U$2 = INSTRUO:EURO_POWER2
U$4 = INSTRUO:1X3_SMALL